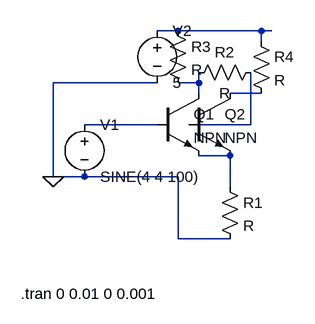
[diagram p0: schematic SchmittTrigger.asc]
SchmittTrigger.asc, the LTspice schematic file:
Version 4
SHEET 1 880 680
WIRE 272 -64 240 -64
WIRE 400 -64 272 -64
WIRE 416 -64 400 -64
WIRE 400 -48 400 -64
WIRE 240 16 80 16
WIRE 304 16 304 0
WIRE 304 16 272 16
WIRE 304 32 304 16
WIRE 400 32 352 32
WIRE 240 80 128 80
WIRE 384 80 384 0
WIRE 384 80 288 80
WIRE 352 128 304 128
WIRE 80 160 80 16
WIRE 128 160 80 160
WIRE 272 160 128 160
WIRE 352 176 352 128
WIRE 272 256 272 160
WIRE 352 256 272 256
FLAG 80 160 0
SYMBOL voltage 128 64 R0
WINDOW 123 0 0 Left 2
WINDOW 39 0 0 Left 2
SYMATTR InstName V1
SYMATTR Value SINE(4 4 100)
SYMBOL voltage 240 -80 R0
WINDOW 123 0 0 Left 2
WINDOW 39 0 0 Left 2
SYMATTR InstName V2
SYMATTR Value 5
SYMBOL npn 240 32 R0
SYMATTR InstName Q1
SYMBOL npn 288 32 R0
SYMATTR InstName Q2
SYMBOL res 400 -16 R90
WINDOW 0 0 56 VBottom 2
WINDOW 3 32 56 VTop 2
SYMATTR InstName R2
SYMBOL res 256 -80 R0
SYMATTR InstName R3
SYMBOL res 384 -64 R0
SYMATTR InstName R4
SYMBOL res 336 160 R0
SYMATTR InstName R1
TEXT 30 340 Left 2 !.tran 0 0.01 0 0.001

The netlist it stands for:
* SchmittTrigger.asc
V1 N004 0 SINE(4 4 100)
V2 N001 0 5
Q1 N002 N004 N006 0 NPN
Q2 N003 N005 N006 0 NPN
R2 N005 N002 R
R3 N001 N002 R
R4 N001 N003 R
R1 N006 0 R
.model NPN NPN
.model PNP PNP
.lib standard.bjt
.tran 0 0.01 0 0.001
.backanno
.end